# EAGLE board foxBMS_BMS-Extension (EAGLE 6.5.0), part 1 of 2
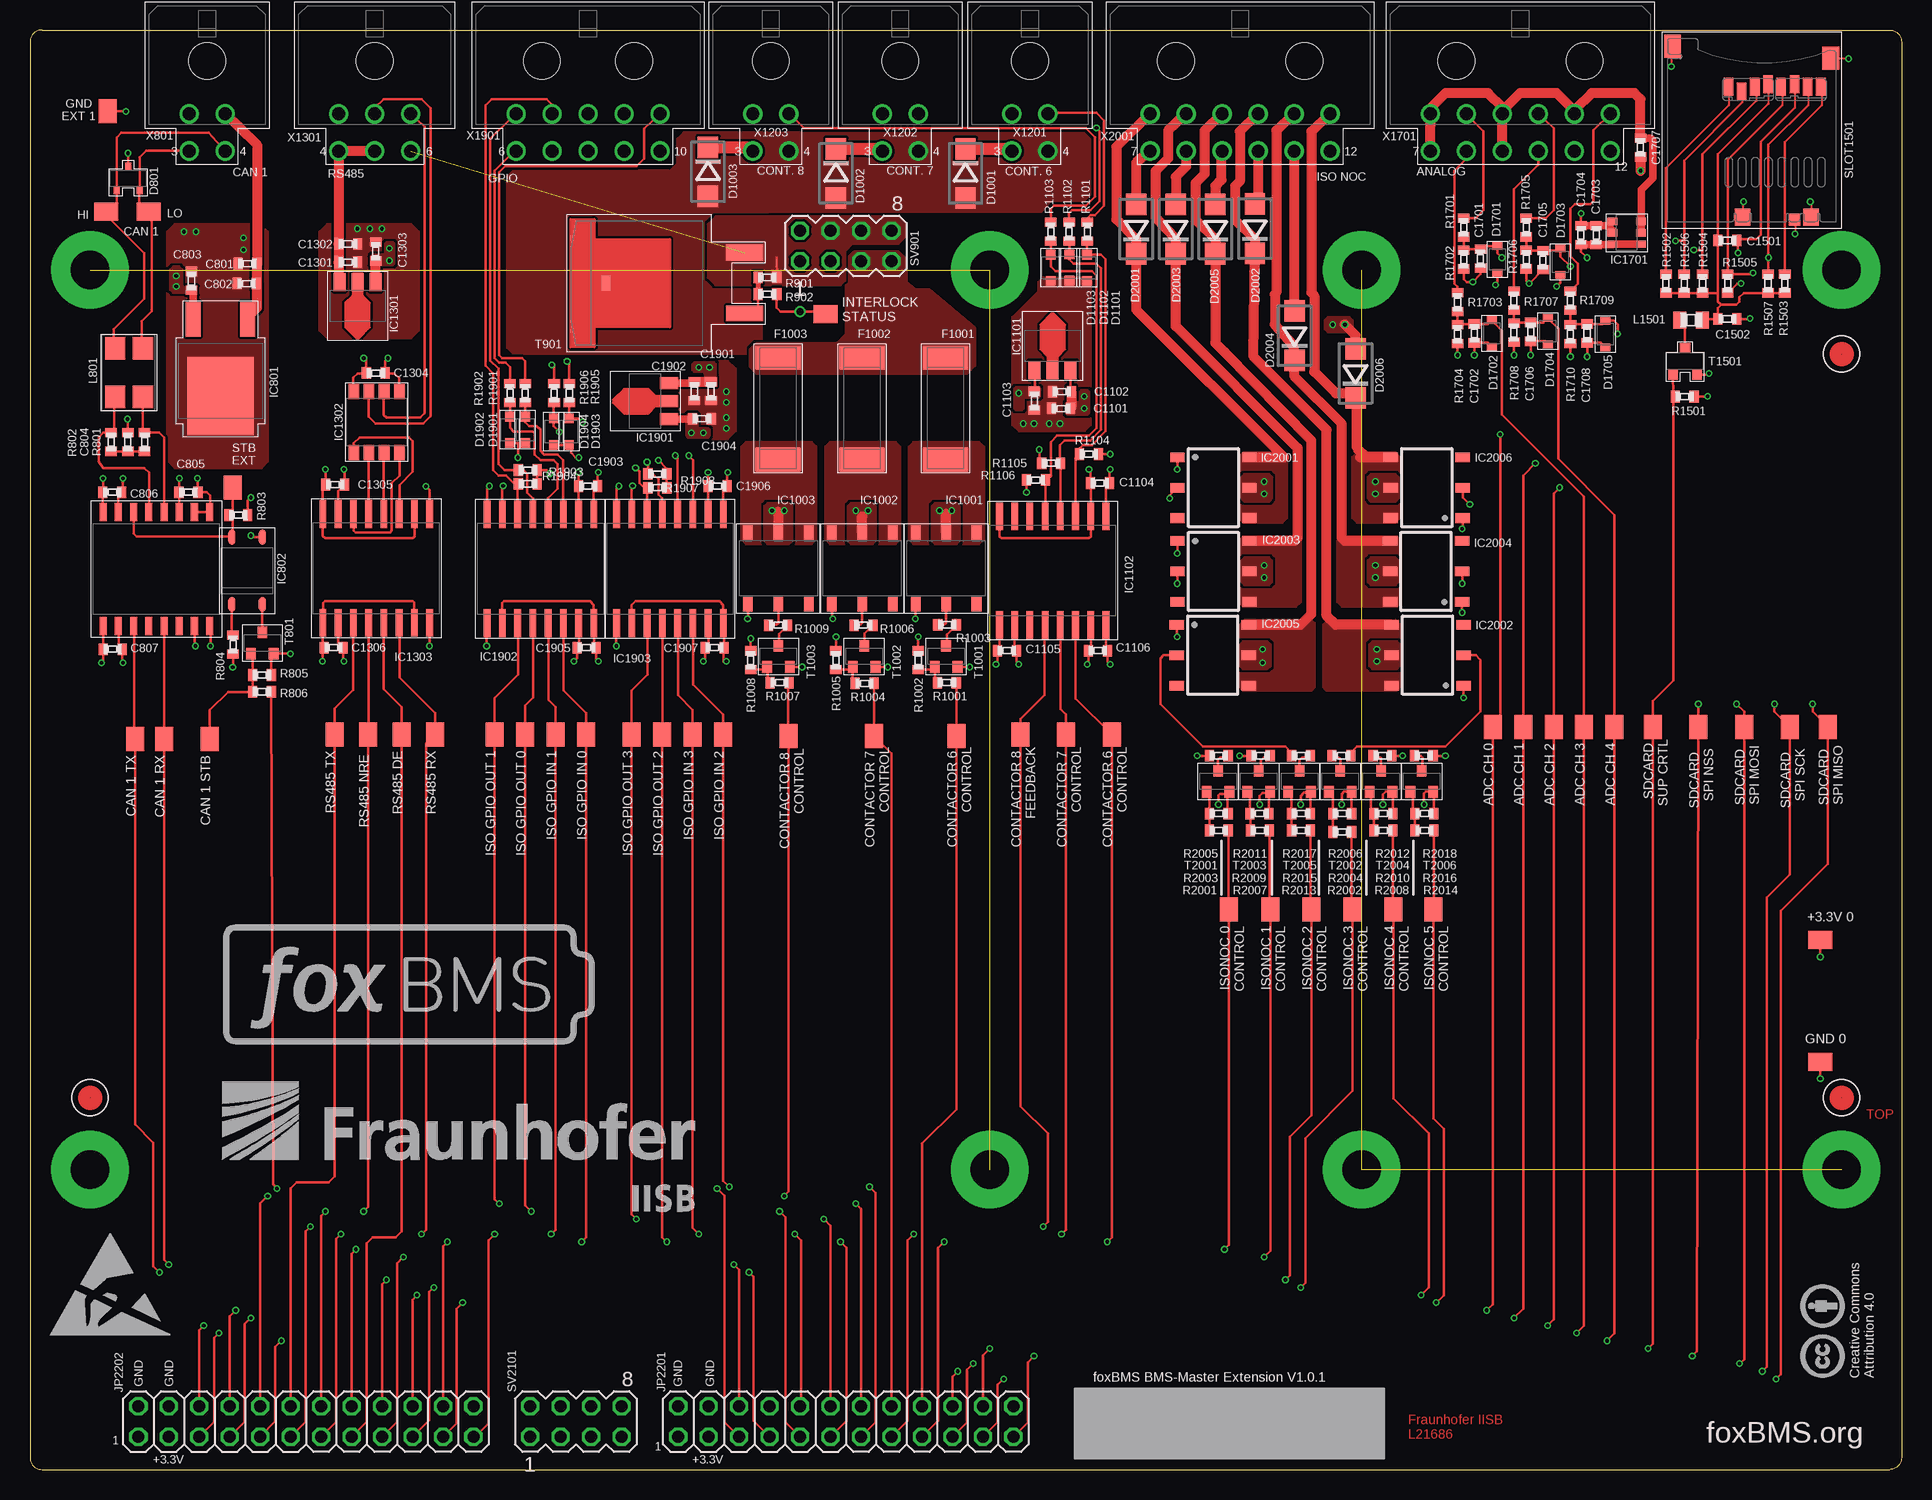
[diagram p22: board, top side]
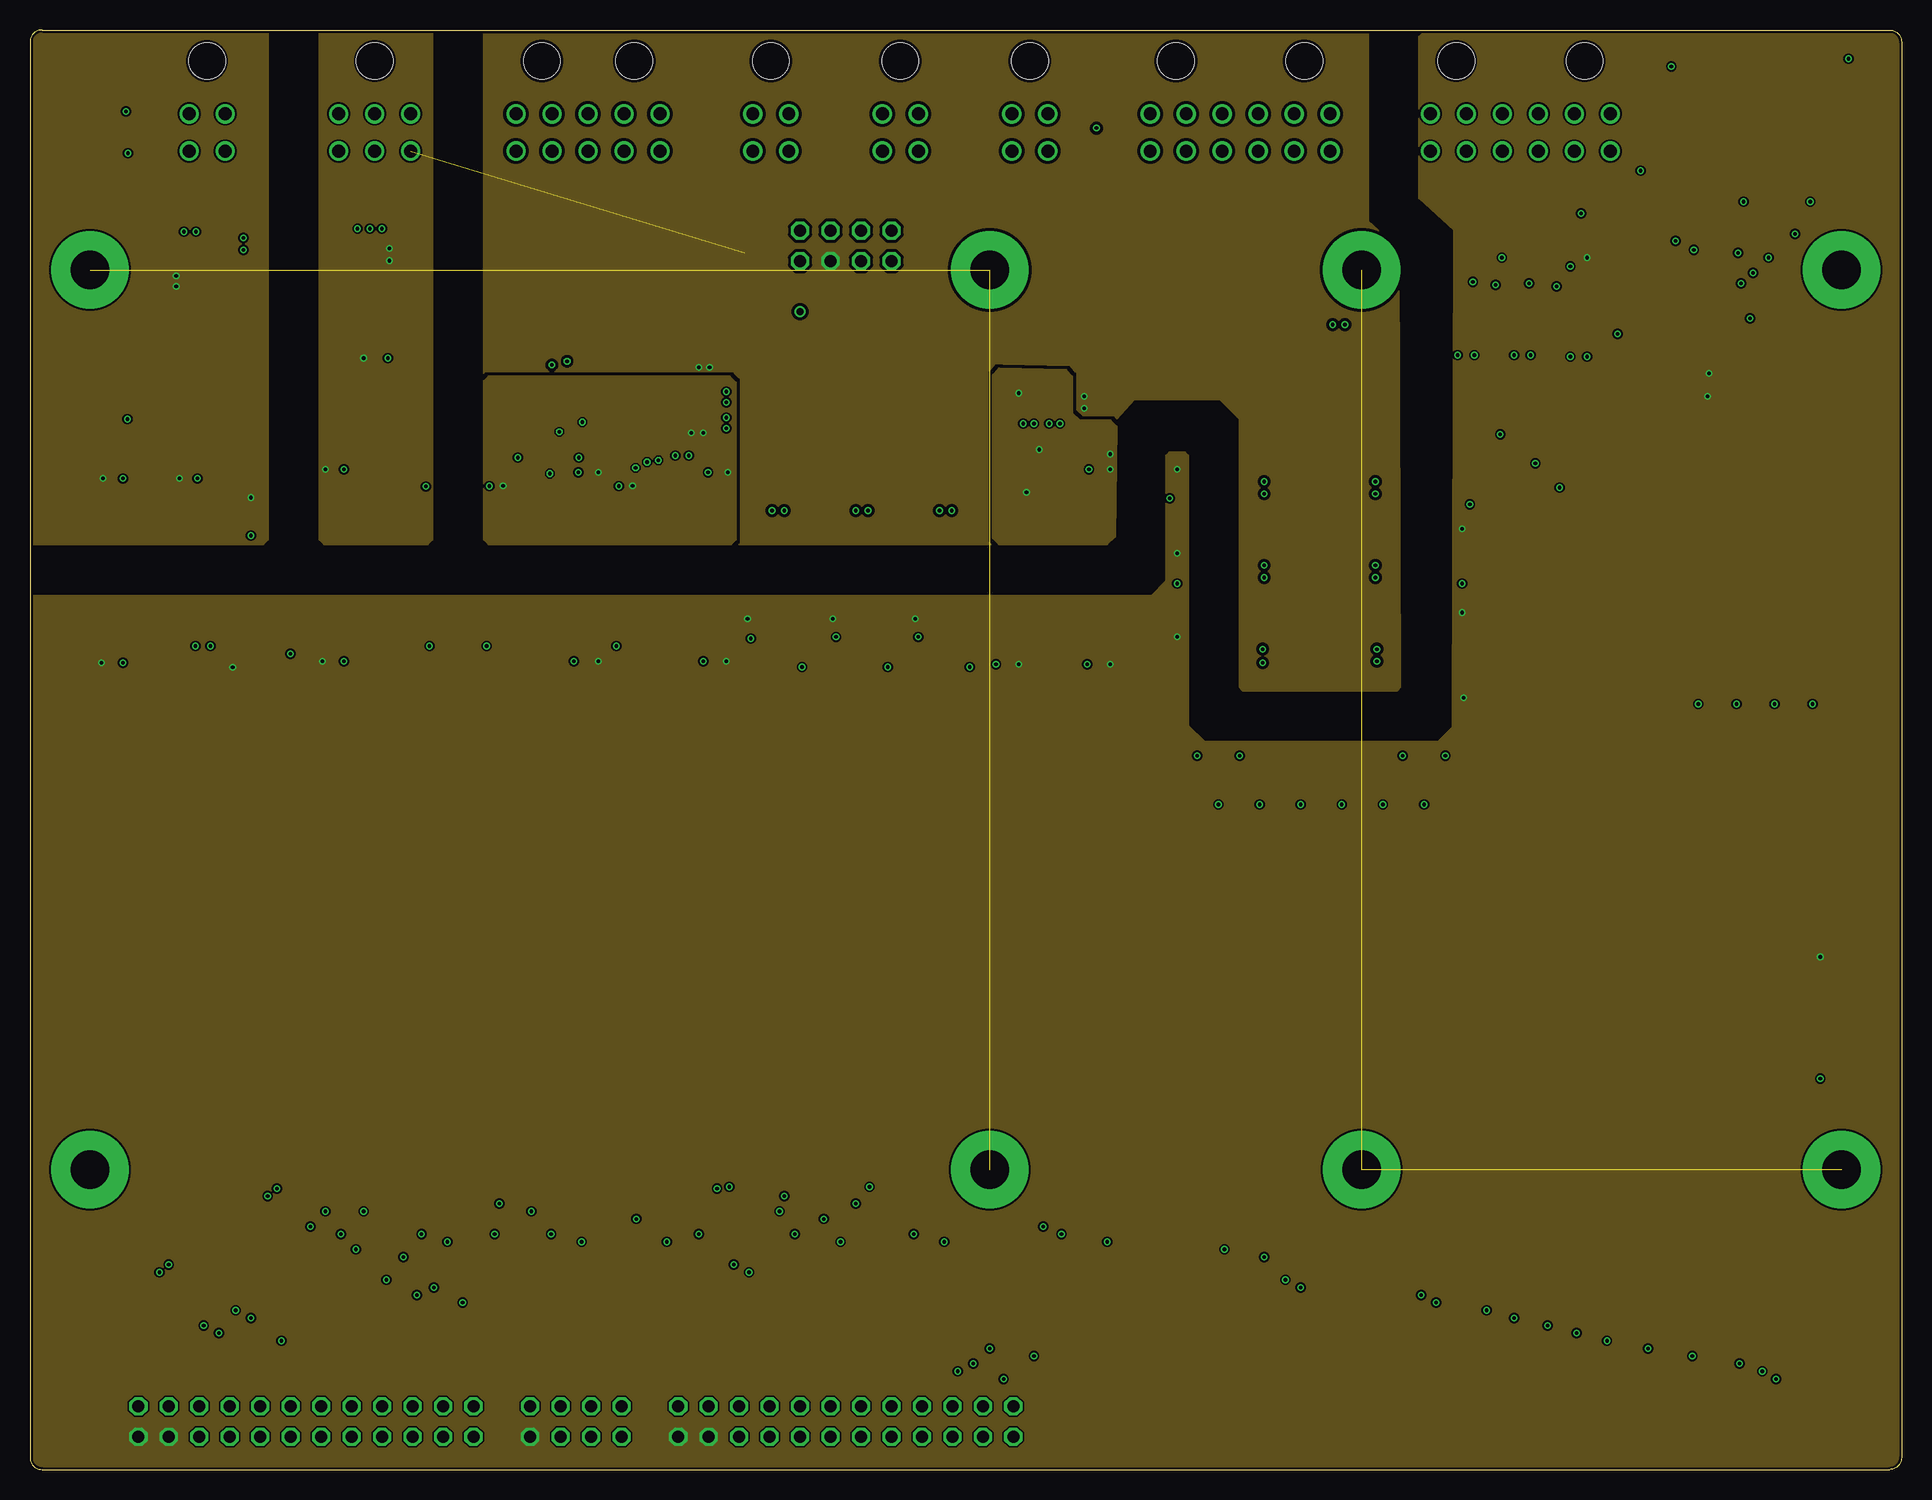
[diagram p23: board, inner layer Route2]
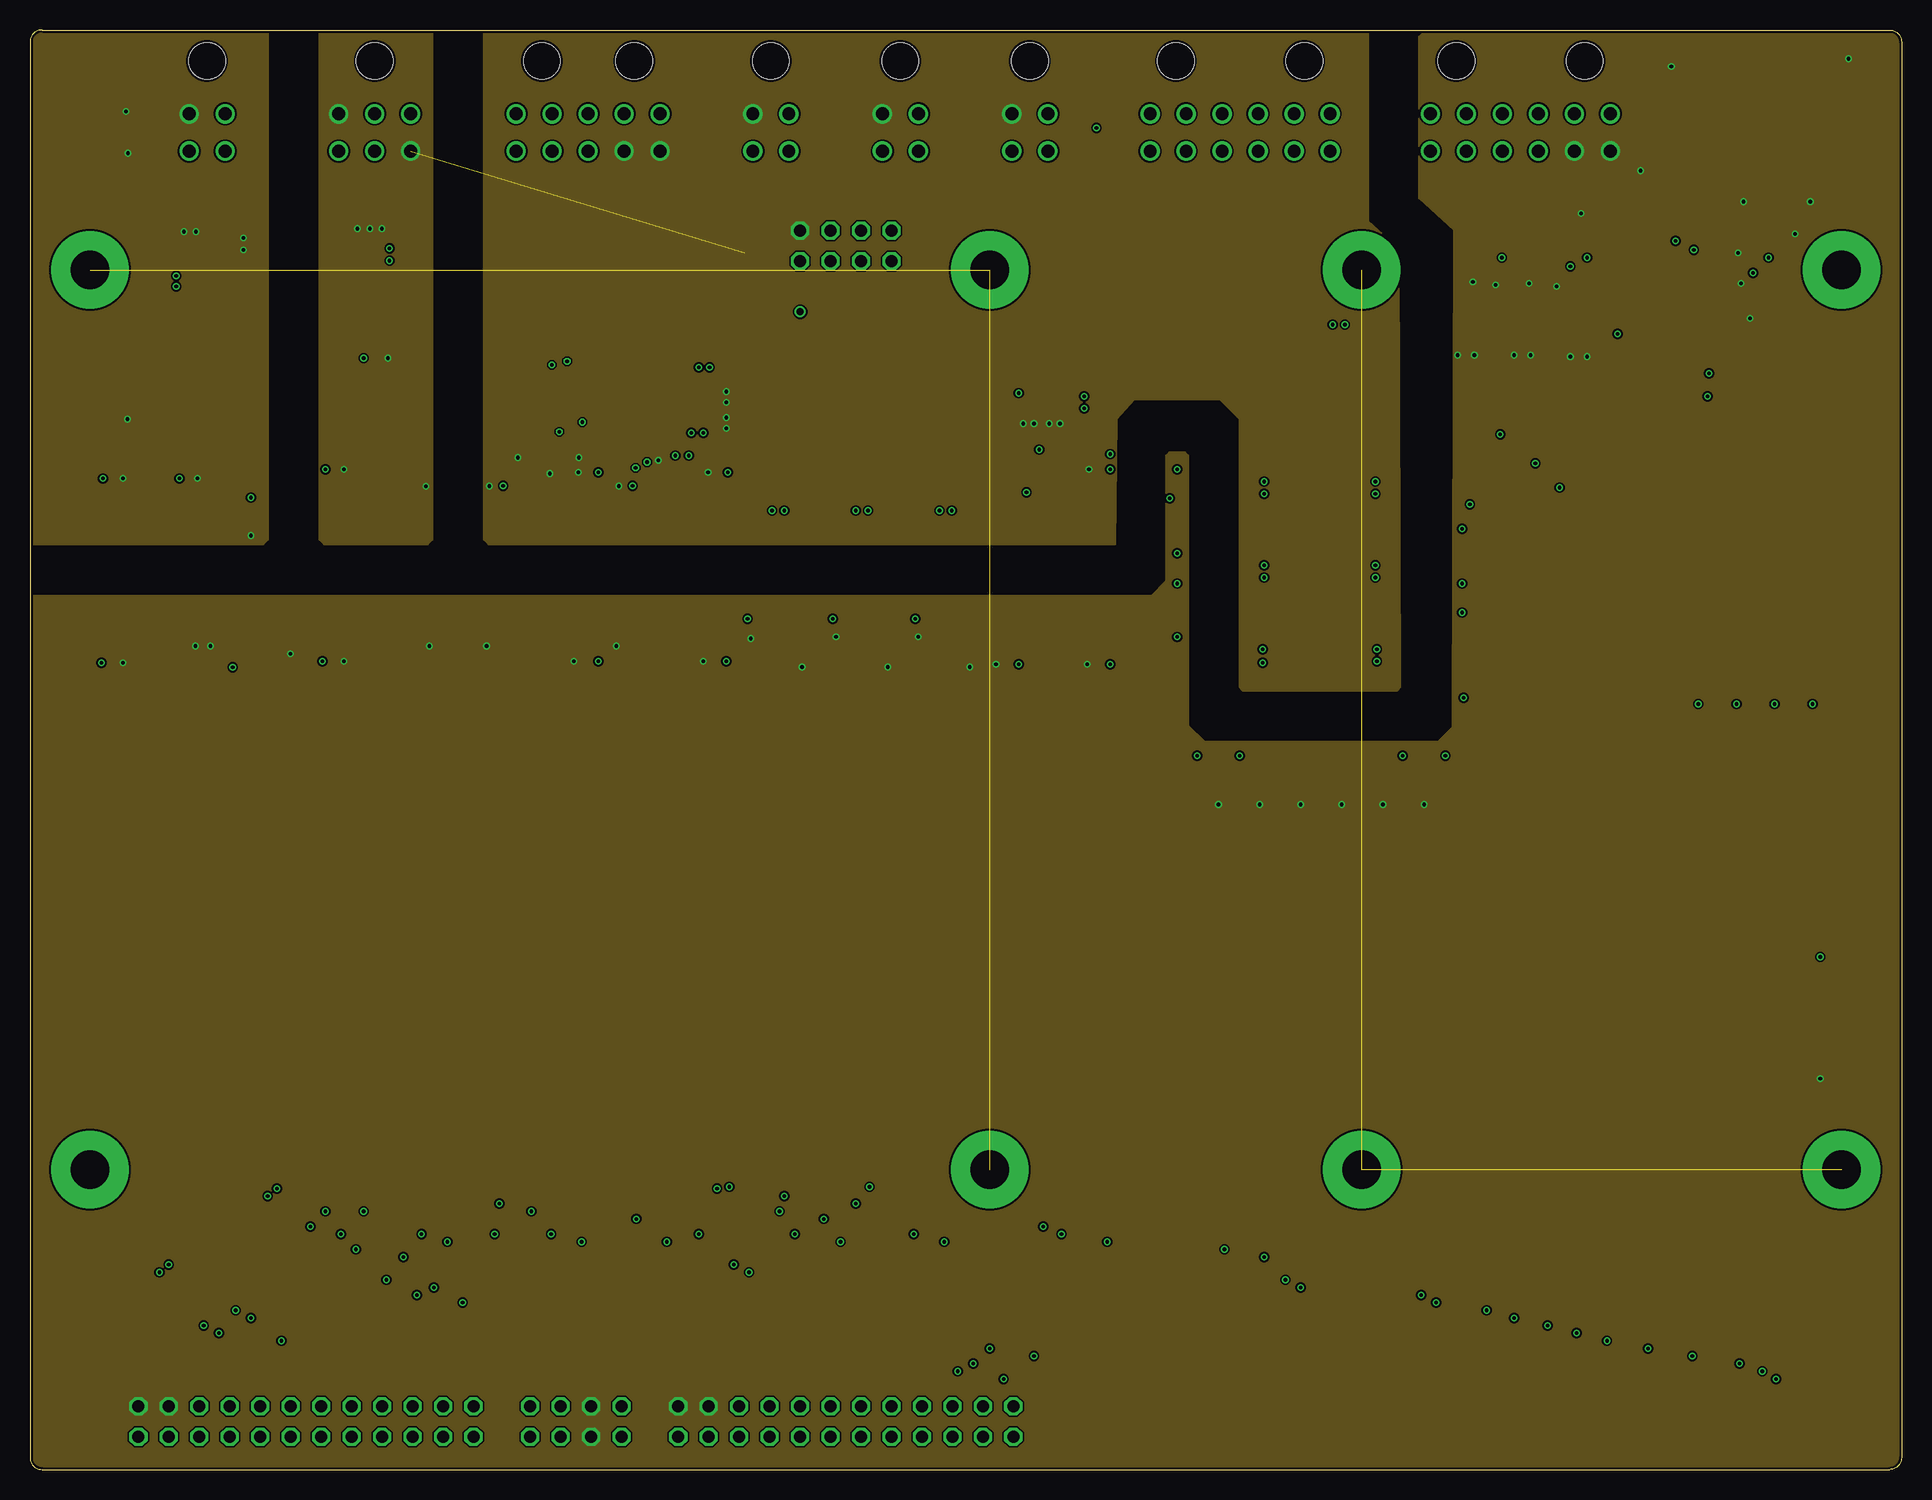
[diagram p24: board, inner layer Route3]
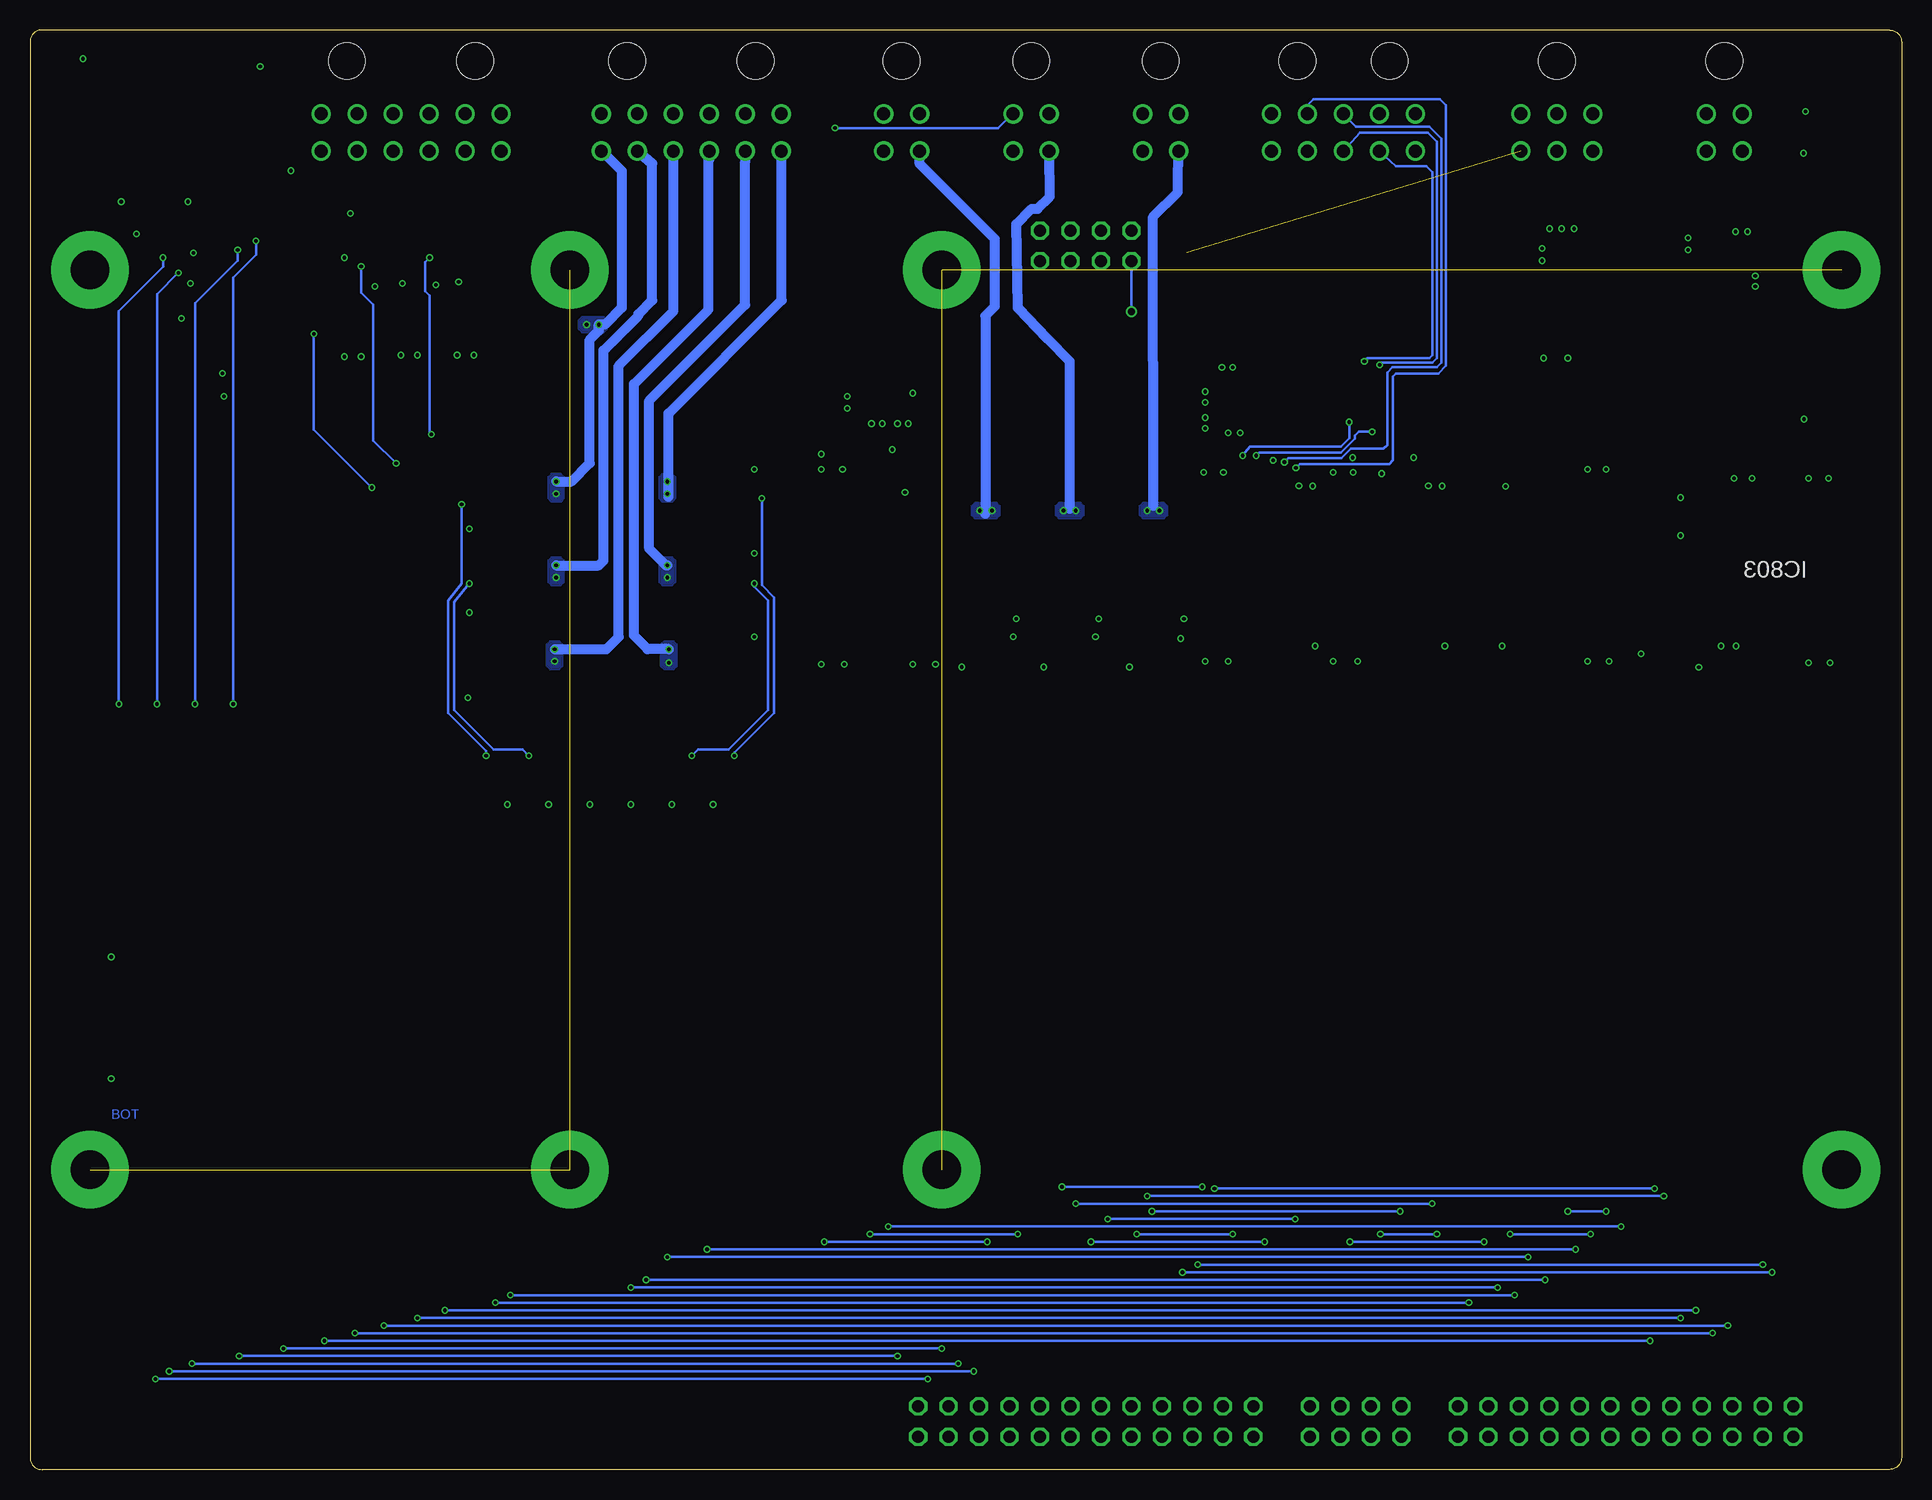
[diagram p25: board, bottom side, seen from below]

Size 156 x 120 mm. Coordinates in mm from the lower left corner, seen from the top.
Outline: 1,120 155,120 arc-90 156,119 156,1 arc-90 155,0 1,0 arc-90 0,1 0,119 arc-90 1,120
Copper layers (1+2*3+16): Top 0.018mm / dielectric 0.36mm / Route2 0.035mm / dielectric 0.71mm / Route3 0.035mm / dielectric 0.36mm / Bottom 0.018mm
Design rules "Multi-CB_4L_125um-Tracks_OL35um-IL35um": minimum track width 0.125mm, minimum drill 0.2mm, track to track 0.125mm, track to pad 0.125mm, pad to pad 0.125mm, via to via 0.125mm, smd to smd 0mil, copper to edge 0.2mm, drill to drill 0.2mm, minimum pad ring 0.125mm, minimum via ring 0.125mm, stop-mask expansion 2mil, vias tented up to drill 0.45mm, thermal gap 0.2mm
Net classes: 0 default: width 0.152 mm, clearance 0.152 mm; 1 controller: width 0.152 mm, clearance 0.152 mm to class 0, clearance 0.152 mm; 3 USB: width 0.152 mm, clearance 0.203 mm to class 0, clearance 0.203 mm to class 1, clearance 0.203 mm to class 2, clearance 0.152 mm; 4 Power: width 0.305 mm, clearance 0.152 mm to class 0, clearance 0.152 mm to class 1, clearance 0.152 mm to class 2, clearance 0.508 mm to class 3, clearance 0.152 mm

## Footprints (pad centres in the part's own frame; a part is rotated, then mirrored left to right if it is on the bottom)
0603 = smd 0.762 x 0.965: 1 -0.787,0; 2 0.787,0
D_SMD_SOT23_(TO-236AB)_R_NXP_REV01 = smd 0.5 x 0.6: 1 -0.95,-1; 2 0.95,-1; 3 0,1
DO214BA = smd 1.8 x 1.7: A 2.05,0; C -2.05,0
D_SMD_SOD323_(SC-76)_R_BOURNS_REV01 = smd 0.8 x 0.8: A -1.1,0; C 1.1,0
D_SMD_SOD323_(SC-76)_R_ON_REV01 = smd 0.625 x 0.83: A -1.113,0; C 1.113,0
F_SMD_11,00MMX3,00MMX3,00MM_(UMT)_R_SCHURTER_REV01 = smd 2 x 3.75: 1 -4.25,0; 2 4.25,0
IC_SMD_TO-252_(D-PAK)_R_FAIRCHILD_REV01 = smd 1.25 x 2.85: 1 -2.28,-4.112; 3 2.288,-4.112 | smd 5.55 x 6.5: 2 0,2.288
K_SMD_SOP-4_R_IXYS_REV01 = smd 0.6 x 1.3: 1 -1.27,-2.8; 2 1.27,-2.8; 3 1.27,2.8; 4 -1.27,2.8
IC_SMD_SO16_(SOT162-1)_R_NXP_REV01 = smd 0.6 x 1.5: 1 -4.445,-4.75; 2 -3.175,-4.75; 3 -1.905,-4.75; 4 -0.635,-4.75; 5 0.635,-4.75; 6 1.905,-4.75; 7 3.175,-4.75; 8 4.445,-4.75; 9 4.445,4.75; 10 3.175,4.75; 11 1.905,4.75; 12 0.635,4.75; 13 -0.635,4.75; 14 -1.905,4.75; 15 -3.175,4.75; 16 -4.445,4.75
K_SMD_SOP-6_R_PANASONIC_REV01 = smd 0.8 x 1.2: 1 -2.54,-3; 2 0,-3; 3 2.54,-3; 4 2.54,3; 5 0,3; 6 -2.54,3
IC_SMD_SOT-89_(SC-62/TO-243)_(R-PSSO-F3)_R_TI_REV01 = smd 1 x 1.5: 1 -1.5,-2; 2 0,-2; 3 1.5,-2
IC_SMD_SOIC-16_(JEDEC_MS-013-AA)_R_ANALOG_REV01 = smd 0.56 x 2.3: 1 -4.445,-4.527; 2 -3.175,-4.527; 3 -1.905,-4.527; 4 -0.635,-4.527; 5 0.635,-4.527; 6 1.905,-4.527; 7 3.175,-4.527; 8 4.445,-4.527; 9 4.445,4.527; 10 3.175,4.527; 11 1.905,4.527; 12 0.635,4.527; 13 -0.635,4.527; 14 -1.905,4.527; 15 -3.175,4.527; 16 -4.445,4.527
IC_SMD_SOIC-8_(S8_REV_G)_R_LINEAR_REV01 = smd 0.889 x 1.27: 1 -1.905,-2.54; 2 -0.635,-2.54; 3 0.635,-2.54; 4 1.905,-2.54; 5 1.905,2.54; 6 0.635,2.54; 7 -0.635,2.54; 8 -1.905,2.54
IC_SMD_SOT23-6_(MO-178-AB)_R_AD_REV01 = smd 0.6 x 0.8: 1 -0.95,-1.2; 2 0,-1.2; 3 0.95,-1.2; 4 0.95,1.2; 5 0,1.2; 6 -0.95,1.2
SOP06 = smd 0.8 x 1.2: 1 -2.54,-3; 2 0,-3; 3 2.54,-3; 4 2.54,3; 5 0,3; 6 -2.54,3
2X12 = drill 1.016 octagon: 1 -13.97,-1.27; 2 -13.97,1.27; 3 -11.43,-1.27; 4 -11.43,1.27; 5 -8.89,-1.27; 6 -8.89,1.27; 7 -6.35,-1.27; 8 -6.35,1.27; 9 -3.81,-1.27; 10 -3.81,1.27; 11 -1.27,-1.27; 12 -1.27,1.27; 13 1.27,-1.27; 14 1.27,1.27; 15 3.81,-1.27; 16 3.81,1.27; 17 6.35,-1.27; 18 6.35,1.27; 19 8.89,-1.27; 20 8.89,1.27; 21 11.43,-1.27; 22 11.43,1.27; 23 13.97,-1.27; 24 13.97,1.27
L_SMD_FILTER_HF_R_EPCOS_SIMDAD_1812_REV01 = smd 1.85 x 1.7: 1 -2.025,1.15; 2 -2.025,-1.15; 3 2.025,-1.15; 4 2.025,1.15
0805 = smd 1.092 x 1.397: 1 -0.94,0; 2 0.94,0
PAD2.0X1.5MM = smd 2 x 1.5: P$1 0,0
X_SMD_MICRO-SD-4735-21001_R_MOLEX_REV01 = smd 0.8 x 1.5: 1 1.94,-3.66; 2 0.84,-3.26; 3 -0.26,-3.66; 4 -1.36,-3.86; 5 -2.46,-3.66; 6 -3.56,-3.86; 7 -4.66,-3.66; 8 -5.76,-3.66 | smd 0.95 x 1: 6_1 -3.56,7.4 | smd 1.4 x 1.9: SH1 -6.6,-6.05; SH2 6.6,-7.05 | smd 1.3 x 1.4: SH3 0.75,7.2; SH5 -4.95,7.2
MA04-2 = drill 1.016 octagon: 1 -3.81,-1.27; 2 -3.81,1.27; 3 -1.27,-1.27; 4 -1.27,1.27; 5 1.27,-1.27; 6 1.27,1.27; 7 3.81,-1.27; 8 3.81,1.27
V_SMD_SOT-23_(TO-236AB)_R_IR_REV01 = smd 0.802 x 0.972: 1 -0.95,-0.885; 2 0.95,-0.885; 3 0,0.885
V_SMD_TO-263_(D²PAK)_R_NXP_REV01 = smd 1.3 x 3.1: 1 -2.54,-6.55; 3 2.54,-6.55 | smd 1.27 x 0.635: 2 0,5
V_SMD_SOT23_(TO-236AB)_R_INFINEON_REV01 = smd 0.8 x 0.9: 1 -1,-1.1; 2 1,-1.1 | smd 0.9 x 0.8: 3 0,1.1
X_TH_MOLEX_43045-0400_R_REV01 = drill 1.07: 1 1.5,4.4; 2 -1.5,4.4; 3 1.5,7.5; 4 -1.5,7.5 | hole 3.05: 0,0
X_TH_MOLEX_43045-0600_R_REV01 = drill 1.07: 1 3,4.4; 2 0,4.4; 3 -3,4.4; 4 3,7.5; 5 0,7.5; 6 -3,7.5 | hole 3.05: 0,0
X_TH_MOLEX_43045-1200_R_REV01 = drill 1.07: 1 7.5,4.4; 2 4.5,4.4; 3 1.5,4.4; 4 -1.5,4.4; 5 -4.5,4.4; 6 -7.5,4.4; 7 7.5,7.5; 8 4.5,7.5; 9 1.5,7.5; 10 -1.5,7.5; 11 -4.5,7.5; 12 -7.5,7.5 | hole 3.05: -5.35,0; 5.35,0
X_TH_MOLEX_43045-1000_R_REV01 = drill 1.07: 1 6,4.4; 2 3,4.4; 3 0,4.4; 4 -3,4.4; 5 -6,4.4; 6 6,7.5; 7 3,7.5; 8 0,7.5; 9 -3,7.5; 10 -6,7.5 | hole 3.05: -3.85,0; 3.85,0

## Placement (x,y rotation side)
C801  2.2µ  [0603]  18.13,100.52 0 top
C802  100n  [0603]  18.07,98.87 0 top
C803  100n  [0603]  13.46,99.09 270 top
C804  100n  [0603]  8.16,85.66 90 top
C805  100n  [0603]  13.21,81.47 180 top
C806  100n  [0603]  6.86,81.47 180 top
C807  100n  [0603]  6.89,68.39 180 top
C1101  100n  [0603]  85.95,88.45 180 top
C1102  1µ  [0603]  86.01,89.85 180 top
C1103  100n  [0603]  83.72,89.09 270 top
C1104  100n  [0603]  89.19,82.23 180 top
C1105  100n  [0603]  81.44,68.26 180 top
C1106  100n  [0603]  89.03,68.26 180 top
C1301  1µ  [0603]  26.51,100.64 0 top
C1302  100n  [0603]  26.51,102.17 0 top
C1303  100n  [0603]  28.83,101.53 90 top
C1304  100n  [0603]  28.83,91.41 0 top
C1305  100n  [0603]  25.43,82.1 0 top
C1306  100n  [0603]  25.3,68.51 0 top
C1501  100n  [0603]  141.48,102.45 180 top
C1502  1µ  [0603]  141.48,95.91 0 top
C1701  100n  [0603]  120.9,100.93 270 top
C1702  100n  [0603]  120.4,94.71 270 top
C1703  1µ  [0603]  130.56,102.9 90 top
C1704  100n  [0603]  129.29,102.9 90 top
C1705  100n  [0603]  126.11,100.8 270 top
C1706  100n  [0603]  125.09,94.83 270 top
C1707  100n  [0603]  134.24,110.2 270 top
C1708  100n  [0603]  129.79,94.71 270 top
C1901  100n  [0603]  56.77,89.88 270 top
C1902  1µ  [0603]  55.37,89.88 270 top
C1903  100n  [0603]  46.51,81.98 180 top
C1904  100n  [0603]  56.01,87.6 0 top
C1905  100n  [0603]  46.39,68.51 180 top
C1906  100n  [0603]  57.31,81.98 180 top
C1907  100n  [0603]  57.05,68.51 180 top
D801  PESD1CAN  [D_SMD_SOT23_(TO-236AB)_R_NXP_REV01]  8.19,107.63 0 top
D1001  [DO214BA]  77.98,108.04 270 top
D1002  [DO214BA]  67.18,108.04 270 top
D1003  [DO214BA]  56.52,108.17 270 top
D1101  CDSOD323-T05  [D_SMD_SOD323_(SC-76)_R_BOURNS_REV01]  88.11,100.17 90 top
D1102  CDSOD323-T05  [D_SMD_SOD323_(SC-76)_R_BOURNS_REV01]  86.65,100.2 90 top
D1103  CDSOD323-T05  [D_SMD_SOD323_(SC-76)_R_BOURNS_REV01]  85.09,100.17 90 top
D1701  MM3Z3V3ST1G  [D_SMD_SOD323_(SC-76)_R_ON_REV01]  122.3,100.87 90 top
D1702  MM3Z3V3ST1G  [D_SMD_SOD323_(SC-76)_R_ON_REV01]  121.86,94.71 90 top
D1703  MM3Z3V3ST1G  [D_SMD_SOD323_(SC-76)_R_ON_REV01]  127.57,100.68 90 top
D1704  MM3Z3V3ST1G  [D_SMD_SOD323_(SC-76)_R_ON_REV01]  126.52,94.9 90 top
D1705  MM3Z3V3ST1G  [D_SMD_SOD323_(SC-76)_R_ON_REV01]  131.32,94.64 90 top
D1901  CDSOD323-T05  [D_SMD_SOD323_(SC-76)_R_BOURNS_REV01]  41.27,86.67 90 top
D1902  CDSOD323-T05  [D_SMD_SOD323_(SC-76)_R_BOURNS_REV01]  40.01,86.67 90 top
D1903  CDSOD323-T05  [D_SMD_SOD323_(SC-76)_R_BOURNS_REV01]  44.93,86.52 90 top
D1904  CDSOD323-T05  [D_SMD_SOD323_(SC-76)_R_BOURNS_REV01]  43.66,86.52 90 top
D2001  [DO214BA]  92.2,103.41 90 top
D2002  [DO214BA]  102.11,103.44 90 top
D2003  [DO214BA]  95.5,103.41 90 top
D2004  [DO214BA]  105.41,94.52 90 top
D2005  [DO214BA]  98.81,103.41 90 top
D2006  [DO214BA]  110.49,91.37 90 top
F1001  630MA_UMT  [F_SMD_11,00MMX3,00MMX3,00MM_(UMT)_R_SCHURTER_REV01]  76.33,88.45 90 top
F1002  630MA_UMT  [F_SMD_11,00MMX3,00MMX3,00MM_(UMT)_R_SCHURTER_REV01]  69.34,88.45 90 top
F1003  630MA_UMT  [F_SMD_11,00MMX3,00MMX3,00MM_(UMT)_R_SCHURTER_REV01]  62.36,88.45 90 top
IC801  KA7805ERTF  [IC_SMD_TO-252_(D-PAK)_R_FAIRCHILD_REV01]  15.88,91.75 180 top
IC802  CPC1008N  [K_SMD_SOP-4_R_IXYS_REV01]  18.1,74.93 0 top
IC803  TJA1052IT/1Y  [IC_SMD_SO16_(SOT162-1)_R_NXP_REV01]  10.54,75.05 0 top
IC1001  AQV252G2S  [K_SMD_SOP-6_R_PANASONIC_REV01]  76.36,75.12 0 top
IC1002  AQV252G2S  [K_SMD_SOP-6_R_PANASONIC_REV01]  69.37,75.12 0 top
IC1003  AQV252G2S  [K_SMD_SOP-6_R_PANASONIC_REV01]  62.39,75.12 0 top
IC1101  UA78L05ACPK  [IC_SMD_SOT-89_(SC-62/TO-243)_(R-PSSO-F3)_R_TI_REV01]  85.25,93.66 0 top
IC1102  ADUM1300ARW  [IC_SMD_SOIC-16_(JEDEC_MS-013-AA)_R_ANALOG_REV01]  85.25,74.93 180 top
IC1301  UA78L05ACPK  [IC_SMD_SOT-89_(SC-62/TO-243)_(R-PSSO-F3)_R_TI_REV01]  27.3,96.99 180 top
IC1302  LTC485CS8#PBF  [IC_SMD_SOIC-8_(S8_REV_G)_R_LINEAR_REV01]  28.89,87.31 0 top
IC1303  ADUM1401ARW  [IC_SMD_SOIC-16_(JEDEC_MS-013-AA)_R_ANALOG_REV01]  28.86,75.12 0 top
IC1701  ADR3425ARJZ  [IC_SMD_SOT23-6_(MO-178-AB)_R_AD_REV01]  133.1,103.09 270 top
IC1901  UA78L05ACPK  [IC_SMD_SOT-89_(SC-62/TO-243)_(R-PSSO-F3)_R_TI_REV01]  51.28,89.06 90 top
IC1902  ADUM1402ARW  [IC_SMD_SOIC-16_(JEDEC_MS-013-AA)_R_ANALOG_REV01]  42.55,75.09 180 top
IC1903  ADUM1402ARW  [IC_SMD_SOIC-16_(JEDEC_MS-013-AA)_R_ANALOG_REV01]  53.34,75.09 180 top
IC2001  AQV25G2S  [SOP06]  98.65,81.85 270 top
IC2002  AQV25G2S  [SOP06]  116.49,67.88 90 top
IC2003  AQV25G2S  [SOP06]  98.65,74.86 270 top
IC2004  AQV25G2S  [SOP06]  116.36,74.86 90 top
IC2005  AQV25G2S  [SOP06]  98.58,67.88 270 top
IC2006  AQV25G2S  [SOP06]  116.43,81.85 90 top
JP2201  [2X12]  68,4 0 top
JP2202  [2X12]  23,4 0 top
L801  B82789C0513N002  [L_SMD_FILTER_HF_R_EPCOS_SIMDAD_1812_REV01]  8.26,91.44 270 top
L1501  22u  [0805]  138.46,95.82 180 top
LSP801  PAD_2.0X1.5MM  [PAD2.0X1.5MM]  6.48,113.22 90 top
LSP802  PAD_2.0X1.5MM  [PAD2.0X1.5MM]  6.35,104.84 0 top
LSP803  PAD_2.0X1.5MM  [PAD2.0X1.5MM]  9.91,104.84 0 top
LSP804  PAD_2.0X1.5MM  [PAD2.0X1.5MM]  16.89,81.85 90 top
LSP805  PAD_2.0X1.5MM  [PAD2.0X1.5MM]  8.76,60.89 90 top
LSP806  PAD_2.0X1.5MM  [PAD2.0X1.5MM]  11.18,60.89 90 top
LSP807  PAD_2.0X1.5MM  [PAD2.0X1.5MM]  14.99,60.89 90 top
LSP901  PAD_2.0X1.5MM  [PAD2.0X1.5MM]  66.29,96.33 0 top
LSP1001  PAD_2.0X1.5MM  [PAD2.0X1.5MM]  77.22,61.15 270 top
LSP1002  PAD_2.0X1.5MM  [PAD2.0X1.5MM]  70.36,61.15 270 top
LSP1003  PAD_2.0X1.5MM  [PAD2.0X1.5MM]  63.25,61.15 270 top
LSP1101  PAD_2.0X1.5MM  [PAD2.0X1.5MM]  90.17,61.27 90 top
LSP1102  PAD_2.0X1.5MM  [PAD2.0X1.5MM]  82.55,61.27 90 top
LSP1103  PAD_2.0X1.5MM  [PAD2.0X1.5MM]  86.36,61.27 90 top
LSP1301  PAD_2.0X1.5MM  [PAD2.0X1.5MM]  25.4,61.27 90 top
LSP1302  PAD_2.0X1.5MM  [PAD2.0X1.5MM]  30.99,61.27 90 top
LSP1303  PAD_2.0X1.5MM  [PAD2.0X1.5MM]  28.19,61.27 90 top
LSP1304  PAD_2.0X1.5MM  [PAD2.0X1.5MM]  33.78,61.27 90 top
LSP1501  PAD_2.0X1.5MM  [PAD2.0X1.5MM]  135.25,61.91 270 top
LSP1502  PAD_2.0X1.5MM  [PAD2.0X1.5MM]  139.06,61.91 270 top
LSP1503  PAD_2.0X1.5MM  [PAD2.0X1.5MM]  142.88,61.91 270 top
LSP1504  PAD_2.0X1.5MM  [PAD2.0X1.5MM]  146.69,61.91 270 top
LSP1505  PAD_2.0X1.5MM  [PAD2.0X1.5MM]  149.86,61.91 270 top
LSP1701  PAD_2.0X1.5MM  [PAD2.0X1.5MM]  121.92,61.91 90 top
LSP1702  PAD_2.0X1.5MM  [PAD2.0X1.5MM]  129.54,61.91 90 top
LSP1703  PAD_2.0X1.5MM  [PAD2.0X1.5MM]  132.08,61.91 90 top
LSP1704  PAD_2.0X1.5MM  [PAD2.0X1.5MM]  124.46,61.91 90 top
LSP1705  PAD_2.0X1.5MM  [PAD2.0X1.5MM]  127,61.91 90 top
LSP1901  PAD_2.0X1.5MM  [PAD2.0X1.5MM]  43.81,61.27 270 top
LSP1902  PAD_2.0X1.5MM  [PAD2.0X1.5MM]  38.73,61.27 270 top
LSP1903  PAD_2.0X1.5MM  [PAD2.0X1.5MM]  46.35,61.27 270 top
LSP1904  PAD_2.0X1.5MM  [PAD2.0X1.5MM]  41.27,61.27 270 top
LSP1905  PAD_2.0X1.5MM  [PAD2.0X1.5MM]  57.78,61.27 270 top
LSP1906  PAD_2.0X1.5MM  [PAD2.0X1.5MM]  52.7,61.27 270 top
LSP1907  PAD_2.0X1.5MM  [PAD2.0X1.5MM]  55.24,61.27 270 top
LSP1908  PAD_2.0X1.5MM  [PAD2.0X1.5MM]  50.16,61.27 270 top
LSP2001  PAD_2.0X1.5MM  [PAD2.0X1.5MM]  99.95,46.67 90 top
LSP2002  PAD_2.0X1.5MM  [PAD2.0X1.5MM]  110.24,46.67 90 top
LSP2003  PAD_2.0X1.5MM  [PAD2.0X1.5MM]  103.38,46.67 90 top
LSP2004  PAD_2.0X1.5MM  [PAD2.0X1.5MM]  113.67,46.67 90 top
LSP2005  PAD_2.0X1.5MM  [PAD2.0X1.5MM]  106.81,46.67 90 top
LSP2006  PAD_2.0X1.5MM  [PAD2.0X1.5MM]  116.97,46.67 90 top
LSP2101  PAD_2.0X1.5MM  [PAD2.0X1.5MM]  149.22,44.13 0 top
LSP2102  PAD_2.0X1.5MM  [PAD2.0X1.5MM]  149.22,33.97 0 top
R801  62R  [0603]  9.56,85.66 270 top
R802  62R  [0603]  6.76,85.66 90 top
R803  10k  [0603]  17.37,79.56 180 top
R804  430  [0603]  16.92,68.77 90 top
R805  10k  [0603]  19.34,66.23 0 top
R806  10  [0603]  19.34,64.83 0 top
R901  10k  [0603]  61.47,99.38 0 top
R902  10  [0603]  61.47,97.98 0 top
R1001  10  [0603]  76.42,65.59 0 top
R1002  10k  [0603]  74.04,67.47 270 top
R1003  430  [0603]  76.45,70.42 180 top
R1004  10  [0603]  69.56,65.53 0 top
R1005  10k  [0603]  67.18,67.47 270 top
R1006  430  [0603]  69.47,70.39 180 top
R1007  10  [0603]  62.48,65.59 0 top
R1008  10k  [0603]  60.07,67.47 270 top
R1009  430  [0603]  62.36,70.39 180 top
R1101  47  [0603]  88.14,103.19 90 top
R1102  47  [0603]  86.61,103.19 90 top
R1103  47  [0603]  85.09,103.19 90 top
R1104  10k  [0603]  88.27,84.64 0 top
R1105  10k  [0603]  85.12,83.88 180 top
R1106  10k  [0603]  83.85,82.48 180 top
R1501  47k  [0603]  137.92,89.44 0 top
R1502  10k  [0603]  136.37,98.87 270 top
R1503  10k  [0603]  146.27,98.87 270 top
R1504  10k  [0603]  139.41,98.87 270 top
R1505  10k  [0603]  141.51,98.87 90 top
R1506  10k  [0603]  137.89,98.87 270 top
R1507  10k  [0603]  144.88,98.87 270 top
R1701  0  [0603]  119.51,103.53 270 top
R1702  4.75k  [0603]  119.51,100.87 270 top
R1703  0  [0603]  119,97.31 270 top
R1704  4.75k  [0603]  119,94.64 270 top
R1705  0  [0603]  124.71,103.53 270 top
R1706  4.75k  [0603]  124.71,100.87 270 top
R1707  0  [0603]  123.7,97.44 270 top
R1708  4.75k  [0603]  123.7,94.77 270 top
R1709  0  [0603]  128.4,97.44 270 top
R1710  4.75k  [0603]  128.4,94.64 270 top
R1901  47  [0603]  41.27,89.72 90 top
R1902  47  [0603]  40.01,89.72 90 top
R1903  10k  [0603]  41.5,83.31 180 top
R1904  10k  [0603]  41.5,82.17 180 top
R1905  47  [0603]  44.96,89.72 90 top
R1906  47  [0603]  43.69,89.72 90 top
R1907  10k  [0603]  52.29,82.99 180 top
R1908  10k  [0603]  52.29,81.85 180 top
R2001  10  [0603]  99.09,53.27 0 top
R2002  10  [0603]  109.38,53.15 0 top
R2003  10k  [0603]  99.09,54.67 180 top
R2004  10k  [0603]  109.38,54.67 180 top
R2005  430  [0603]  99.09,59.5 180 top
R2006  430  [0603]  109.31,59.5 0 top
R2007  10  [0603]  102.52,53.27 0 top
R2008  10  [0603]  112.81,53.27 0 top
R2009  10k  [0603]  102.49,54.67 180 top
R2010  10k  [0603]  112.81,54.67 180 top
R2011  430  [0603]  102.58,59.5 180 top
R2012  430  [0603]  112.74,59.5 0 top
R2013  10  [0603]  105.95,53.27 0 top
R2014  10  [0603]  116.24,53.27 0 top
R2015  10k  [0603]  105.95,54.67 180 top
R2016  10k  [0603]  116.24,54.67 180 top
R2017  430  [0603]  105.95,59.5 180 top
R2018  430  [0603]  116.17,59.5 0 top
SLOT1501  MICRO_SD  [X_SMD_MICRO-SD-4735-21001_R_MOLEX_REV01]  143.51,111.6 180 top
SV901  [MA04-2]  68,102 0 top
SV2101  [MA04-2]  45.5,4 0 top
T801  IRLML0100TRPBF  [V_SMD_SOT-23_(TO-236AB)_R_IR_REV01]  19.37,68.9 0 top
T901  BUK964R8-60E  [V_SMD_TO-263_(D²PAK)_R_NXP_REV01]  53.02,98.9 90 top
T1001  IRLML0100TRPBF  [V_SMD_SOT-23_(TO-236AB)_R_IR_REV01]  76.36,67.78 0 top
T1002  IRLML0100TRPBF  [V_SMD_SOT-23_(TO-236AB)_R_IR_REV01]  69.53,67.78 0 top
T1003  IRLML0100TRPBF  [V_SMD_SOT-23_(TO-236AB)_R_IR_REV01]  62.39,67.78 0 top
T1501  BSS84P  [V_SMD_SOT23_(TO-236AB)_R_INFINEON_REV01]  137.95,92.39 0 top
T2001  IRLML0100TRPBF  [V_SMD_SOT-23_(TO-236AB)_R_IR_REV01]  99.03,57.37 0 top
T2002  IRLML0100TRPBF  [V_SMD_SOT-23_(TO-236AB)_R_IR_REV01]  109.22,57.37 0 top
T2003  IRLML0100TRPBF  [V_SMD_SOT-23_(TO-236AB)_R_IR_REV01]  102.43,57.37 0 top
T2004  IRLML0100TRPBF  [V_SMD_SOT-23_(TO-236AB)_R_IR_REV01]  112.62,57.37 0 top
T2005  IRLML0100TRPBF  [V_SMD_SOT-23_(TO-236AB)_R_IR_REV01]  105.82,57.37 0 top
T2006  IRLML0100TRPBF  [V_SMD_SOT-23_(TO-236AB)_R_IR_REV01]  116.01,57.37 0 top
U$1  [ESD_10.00]  1.59,11.11 0 top
U$2  [FIDUCIAL_1MM]  151,93 0 top
U$3  [FIDUCIAL_1MM]  5,31 0 top
U$4  [FIDUCIAL_1MM]  151,31 0 top
X801  43045-0400_MOLEX_4PIN  [X_TH_MOLEX_43045-0400_R_REV01]  14.76,117.41 180 top
X1201  43045-0400_MOLEX_4PIN  [X_TH_MOLEX_43045-0400_R_REV01]  83.34,117.41 180 top
X1202  43045-0400_MOLEX_4PIN  [X_TH_MOLEX_43045-0400_R_REV01]  72.55,117.41 180 top
X1203  43045-0400_MOLEX_4PIN  [X_TH_MOLEX_43045-0400_R_REV01]  61.75,117.41 180 top
X1301  43045-0600_MOLEX_6PIN  [X_TH_MOLEX_43045-0600_R_REV01]  28.73,117.41 180 top
X1701  43045-1200_MOLEX_12PIN  [X_TH_MOLEX_43045-1200_R_REV01]  124.24,117.41 180 top
X1901  43045-1000_MOLEX_10PIN  [X_TH_MOLEX_43045-1000_R_REV01]  46.51,117.41 180 top
X2001  43045-1200_MOLEX_12PIN  [X_TH_MOLEX_43045-1200_R_REV01]  100.87,117.41 180 top